# EAGLE schematic sr42-revB-kbd (EAGLE 9.6.2)

## Sheet 1 of 3
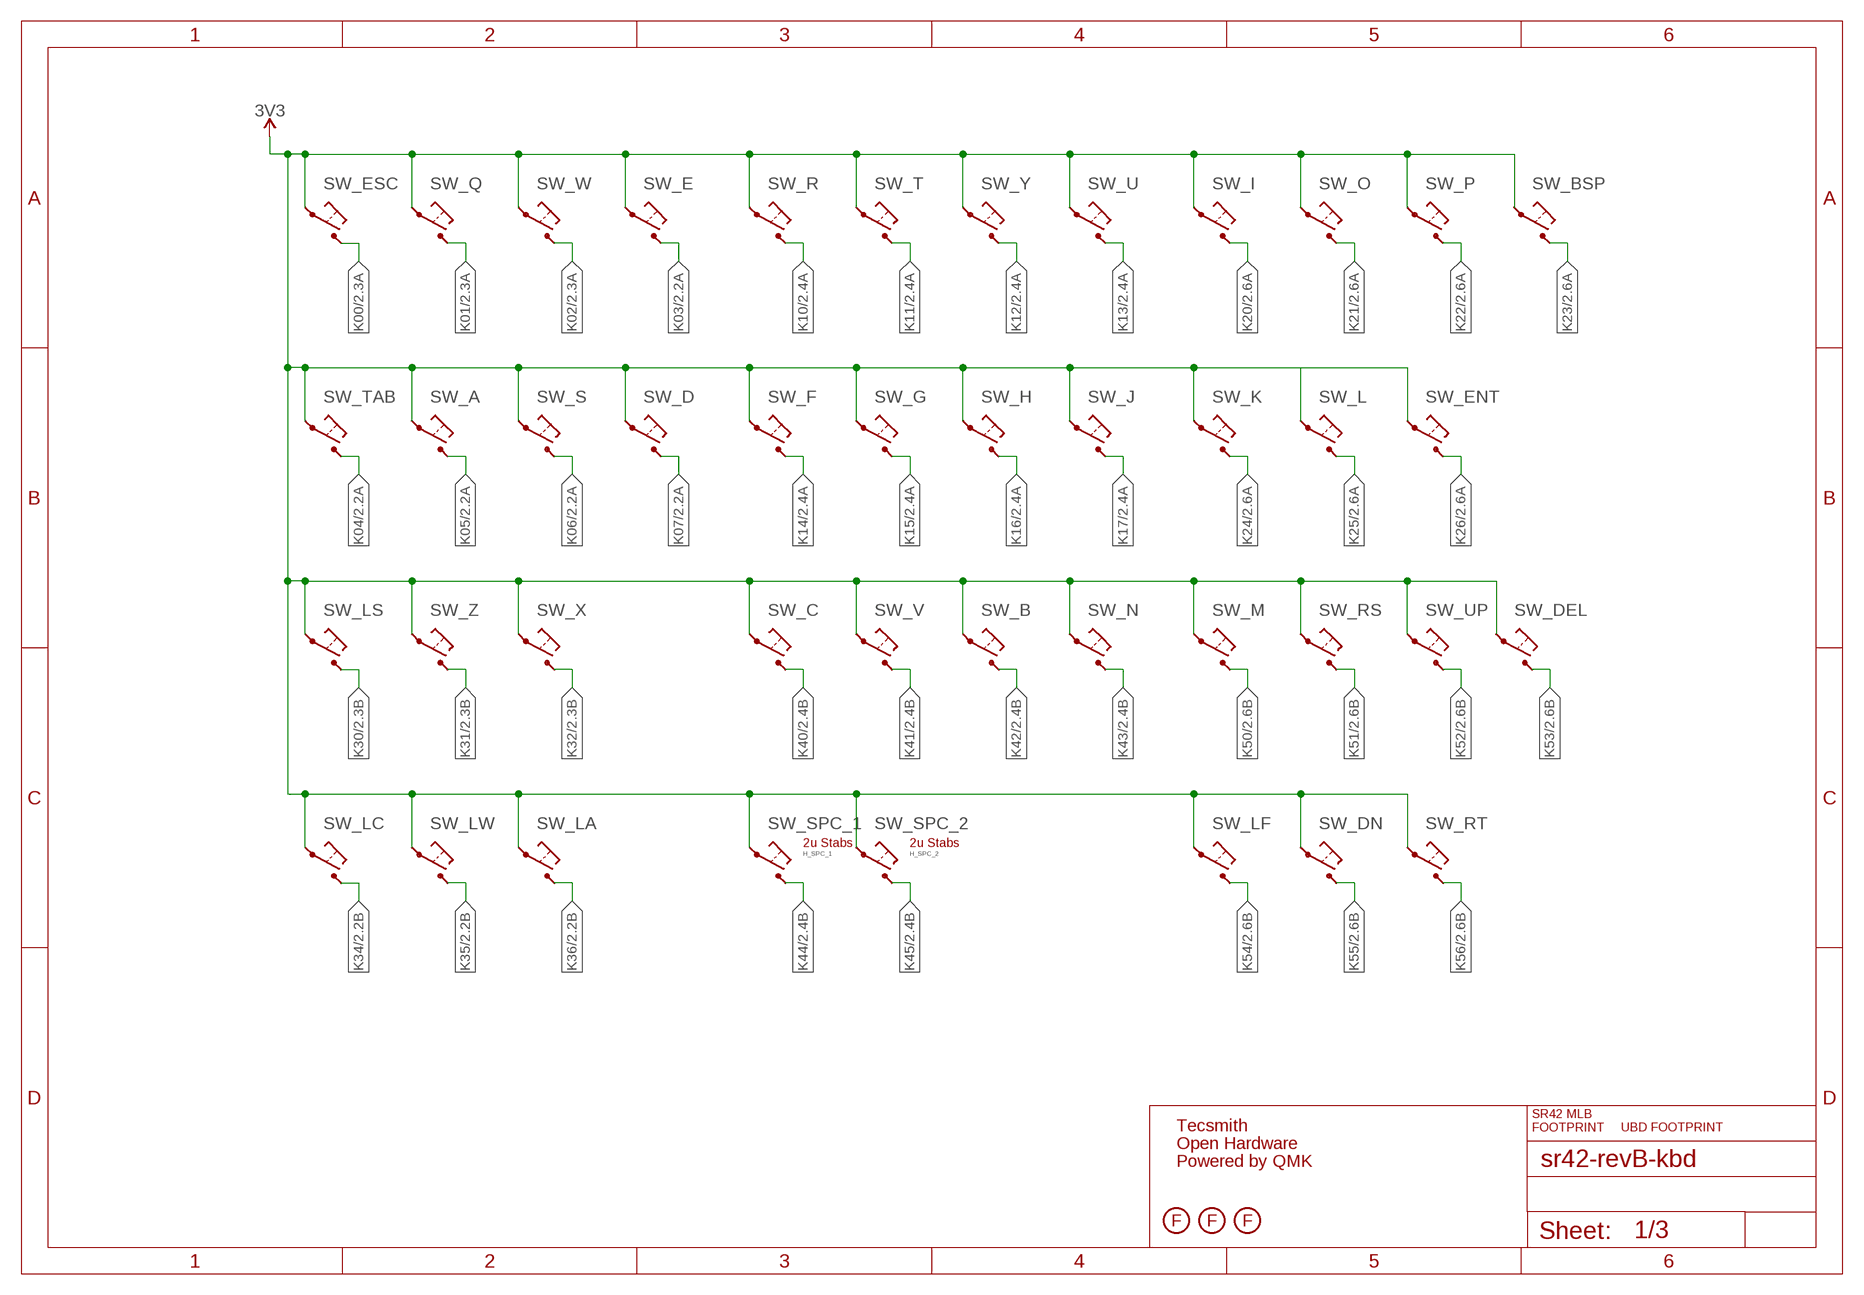
[diagram p0: schematic, sheet 1]

### Parts
H_SPC_1  MX-STABS-200U  [MX-STABS-200U]
H_SPC_2  MX-STABS-200U  [MX-STABS-200U]
LOGO1  OSHW-LOGOL  [OSHW-LOGO-L]
SW_A  MX-5-PIN-HOTSWAP-PAD  [MX-5-PIN-HOTSWAP-PAD]
SW_B  MX-5-PIN-HOTSWAP-PAD  [MX-5-PIN-HOTSWAP-PAD]
SW_BSP  MX-5-PIN-HOTSWAP-PAD  [MX-5-PIN-HOTSWAP-PAD]
SW_C  MX-5-PIN-HOTSWAP-PAD  [MX-5-PIN-HOTSWAP-PAD]
SW_D  MX-5-PIN-HOTSWAP-PAD  [MX-5-PIN-HOTSWAP-PAD]
SW_DEL  MX-5-PIN-HOTSWAP-PAD  [MX-5-PIN-HOTSWAP-PAD]
SW_DN  MX-5-PIN-HOTSWAP-PAD  [MX-5-PIN-HOTSWAP-PAD]
SW_E  MX-5-PIN-HOTSWAP-PAD  [MX-5-PIN-HOTSWAP-PAD]
SW_ENT  MX-5-PIN-HOTSWAP-PAD  [MX-5-PIN-HOTSWAP-PAD]
SW_ESC  MX-5-PIN-HOTSWAP-PAD  [MX-5-PIN-HOTSWAP-PAD]
SW_F  MX-5-PIN-HOTSWAP-PAD  [MX-5-PIN-HOTSWAP-PAD]
SW_G  MX-5-PIN-HOTSWAP-PAD  [MX-5-PIN-HOTSWAP-PAD]
SW_H  MX-5-PIN-HOTSWAP-PAD  [MX-5-PIN-HOTSWAP-PAD]
SW_I  MX-5-PIN-HOTSWAP-PAD  [MX-5-PIN-HOTSWAP-PAD]
SW_J  MX-5-PIN-HOTSWAP-PAD  [MX-5-PIN-HOTSWAP-PAD]
SW_K  MX-5-PIN-HOTSWAP-PAD  [MX-5-PIN-HOTSWAP-PAD]
SW_L  MX-5-PIN-HOTSWAP-PAD  [MX-5-PIN-HOTSWAP-PAD]
SW_LA  MX-5-PIN-HOTSWAP-PAD  [MX-5-PIN-HOTSWAP-PAD]
SW_LC  MX-5-PIN-HOTSWAP-PAD  [MX-5-PIN-HOTSWAP-PAD]
SW_LF  MX-5-PIN-HOTSWAP-PAD  [MX-5-PIN-HOTSWAP-PAD]
SW_LS  MX-5-PIN-HOTSWAP-PAD  [MX-5-PIN-HOTSWAP-PAD]
SW_LW  MX-5-PIN-HOTSWAP-PAD  [MX-5-PIN-HOTSWAP-PAD]
SW_M  MX-5-PIN-HOTSWAP-PAD  [MX-5-PIN-HOTSWAP-PAD]
SW_N  MX-5-PIN-HOTSWAP-PAD  [MX-5-PIN-HOTSWAP-PAD]
SW_O  MX-5-PIN-HOTSWAP-PAD  [MX-5-PIN-HOTSWAP-PAD]
SW_P  MX-5-PIN-HOTSWAP-PAD  [MX-5-PIN-HOTSWAP-PAD]
SW_Q  MX-5-PIN-HOTSWAP-PAD  [MX-5-PIN-HOTSWAP-PAD]
SW_R  MX-5-PIN-HOTSWAP-PAD  [MX-5-PIN-HOTSWAP-PAD]
SW_RS  MX-5-PIN-HOTSWAP-PAD  [MX-5-PIN-HOTSWAP-PAD]
SW_RT  MX-5-PIN-HOTSWAP-PAD  [MX-5-PIN-HOTSWAP-PAD]
SW_S  MX-5-PIN-HOTSWAP-PAD  [MX-5-PIN-HOTSWAP-PAD]
SW_SPC_1  MX-5-PIN-HOTSWAP-PAD  [MX-5-PIN-HOTSWAP-PAD]
SW_SPC_2  MX-5-PIN-HOTSWAP-PAD  [MX-5-PIN-HOTSWAP-PAD]
SW_T  MX-5-PIN-HOTSWAP-PAD  [MX-5-PIN-HOTSWAP-PAD]
SW_TAB  MX-5-PIN-HOTSWAP-PAD  [MX-5-PIN-HOTSWAP-PAD]
SW_U  MX-5-PIN-HOTSWAP-PAD  [MX-5-PIN-HOTSWAP-PAD]
SW_UP  MX-5-PIN-HOTSWAP-PAD  [MX-5-PIN-HOTSWAP-PAD]
SW_V  MX-5-PIN-HOTSWAP-PAD  [MX-5-PIN-HOTSWAP-PAD]
SW_W  MX-5-PIN-HOTSWAP-PAD  [MX-5-PIN-HOTSWAP-PAD]
SW_X  MX-5-PIN-HOTSWAP-PAD  [MX-5-PIN-HOTSWAP-PAD]
SW_Y  MX-5-PIN-HOTSWAP-PAD  [MX-5-PIN-HOTSWAP-PAD]
SW_Z  MX-5-PIN-HOTSWAP-PAD  [MX-5-PIN-HOTSWAP-PAD]
U$1  SR42_MLB_FOOTPRINT  [SR42_MLB_FOOTPRINT]
U$2  UBD_FOOTPRINT  [UDB_FOOTPRINT]
U$3  TECSMITH-LOGOLONG  [TECSMITH-NAME]
U$4  QMK_LOGO  [QMK_LOGO]
U$5  FIDUCIAL  [FIDUCIAL]
U$6  FIDUCIAL  [FIDUCIAL]
U$7  FIDUCIAL  [FIDUCIAL]

### Nets
K00: SW_ESC.1@1(P) SW_ESC.1@2(P) ; also sheet 2
K01: SW_Q.1@1(P) SW_Q.1@2(P) ; also sheet 2
K02: SW_W.1@1(P) SW_W.1@2(P) ; also sheet 2
K03: SW_E.1@1(P) SW_E.1@2(P) ; also sheet 2
K04: SW_TAB.1@1(P) SW_TAB.1@2(P) ; also sheet 2
K05: SW_A.1@1(P) SW_A.1@2(P) ; also sheet 2
K06: SW_S.1@1(P) SW_S.1@2(P) ; also sheet 2
K07: SW_D.1@1(P) SW_D.1@2(P) ; also sheet 2
K10: SW_R.1@1(P) SW_R.1@2(P) ; also sheet 2
K11: SW_T.1@1(P) SW_T.1@2(P) ; also sheet 2
K12: SW_Y.1@1(P) SW_Y.1@2(P) ; also sheet 2
K13: SW_U.1@1(P) SW_U.1@2(P) ; also sheet 2
K14: SW_F.1@1(P) SW_F.1@2(P) ; also sheet 2
K15: SW_G.1@1(P) SW_G.1@2(P) ; also sheet 2
K16: SW_H.1@1(P) SW_H.1@2(P) ; also sheet 2
K17: SW_J.1@1(P) SW_J.1@2(P) ; also sheet 2
K20: SW_I.1@1(P) SW_I.1@2(P) ; also sheet 2
K21: SW_O.1@1(P) SW_O.1@2(P) ; also sheet 2
K22: SW_P.1@1(P) SW_P.1@2(P) ; also sheet 2
K23: SW_BSP.1@1(P) SW_BSP.1@2(P) ; also sheet 2
K24: SW_K.1@1(P) SW_K.1@2(P) ; also sheet 2
K25: SW_L.1@1(P) SW_L.1@2(P) ; also sheet 2
K26: SW_ENT.1@1(P) SW_ENT.1@2(P) ; also sheet 2
K30: SW_LS.1@1(P) SW_LS.1@2(P) ; also sheet 2
K31: SW_Z.1@1(P) SW_Z.1@2(P) ; also sheet 2
K32: SW_X.1@1(P) SW_X.1@2(P) ; also sheet 2
K34: SW_LC.1@1(P) SW_LC.1@2(P) ; also sheet 2
K35: SW_LW.1@1(P) SW_LW.1@2(P) ; also sheet 2
K36: SW_LA.1@1(P) SW_LA.1@2(P) ; also sheet 2
K40: SW_C.1@1(P) SW_C.1@2(P) ; also sheet 2
K41: SW_V.1@1(P) SW_V.1@2(P) ; also sheet 2
K42: SW_B.1@1(P) SW_B.1@2(P) ; also sheet 2
K43: SW_N.1@1(P) SW_N.1@2(P) ; also sheet 2
K44: SW_SPC_1.1@1(P) SW_SPC_1.1@2(P) ; also sheet 2
K45: SW_SPC_2.1@1(P) SW_SPC_2.1@2(P) ; also sheet 2
K50: SW_M.1@1(P) SW_M.1@2(P) ; also sheet 2
K51: SW_RS.1@1(P) SW_RS.1@2(P) ; also sheet 2
K52: SW_UP.1@1(P) SW_UP.1@2(P) ; also sheet 2
K53: SW_DEL.1@1(P) SW_DEL.1@2(P) ; also sheet 2
K54: SW_LF.1@1(P) SW_LF.1@2(P) ; also sheet 2
K55: SW_DN.1@1(P) SW_DN.1@2(P) ; also sheet 2
K56: SW_RT.1@1(P) SW_RT.1@2(P) ; also sheet 2
VCC_2: SW_A.2@1(S) SW_A.2@2(S) SW_B.2@1(S) SW_B.2@2(S) SW_BSP.2@1(S) SW_BSP.2@2(S) SW_C.2@1(S) SW_C.2@2(S) SW_D.2@1(S) SW_D.2@2(S) SW_DEL.2@1(S) SW_DEL.2@2(S) SW_DN.2@1(S) SW_DN.2@2(S) SW_E.2@1(S) SW_E.2@2(S) SW_ENT.2@1(S) SW_ENT.2@2(S) SW_ESC.2@1(S) SW_ESC.2@2(S) SW_F.2@1(S) SW_F.2@2(S) SW_G.2@1(S) SW_G.2@2(S) SW_H.2@1(S) SW_H.2@2(S) SW_I.2@1(S) SW_I.2@2(S) SW_J.2@1(S) SW_J.2@2(S) SW_K.2@1(S) SW_K.2@2(S) SW_L.2@1(S) SW_L.2@2(S) SW_LA.2@1(S) SW_LA.2@2(S) SW_LC.2@1(S) SW_LC.2@2(S) SW_LF.2@1(S) SW_LF.2@2(S) SW_LS.2@1(S) SW_LS.2@2(S) SW_LW.2@1(S) SW_LW.2@2(S) SW_M.2@1(S) SW_M.2@2(S) SW_N.2@1(S) SW_N.2@2(S) SW_O.2@1(S) SW_O.2@2(S) SW_P.2@1(S) SW_P.2@2(S) SW_Q.2@1(S) SW_Q.2@2(S) SW_R.2@1(S) SW_R.2@2(S) SW_RS.2@1(S) SW_RS.2@2(S) SW_RT.2@1(S) SW_RT.2@2(S) SW_S.2@1(S) SW_S.2@2(S) SW_SPC_1.2@1(S) SW_SPC_1.2@2(S) SW_SPC_2.2@1(S) SW_SPC_2.2@2(S) SW_T.2@1(S) SW_T.2@2(S) SW_TAB.2@1(S) SW_TAB.2@2(S) SW_U.2@1(S) SW_U.2@2(S) SW_UP.2@1(S) SW_UP.2@2(S) SW_V.2@1(S) SW_V.2@2(S) SW_W.2@1(S) SW_W.2@2(S) SW_X.2@1(S) SW_X.2@2(S) SW_Y.2@1(S) SW_Y.2@2(S) SW_Z.2@1(S) SW_Z.2@2(S) ; supply symbol labelled 3V3 ; also sheet 2

## Sheet 2 of 3
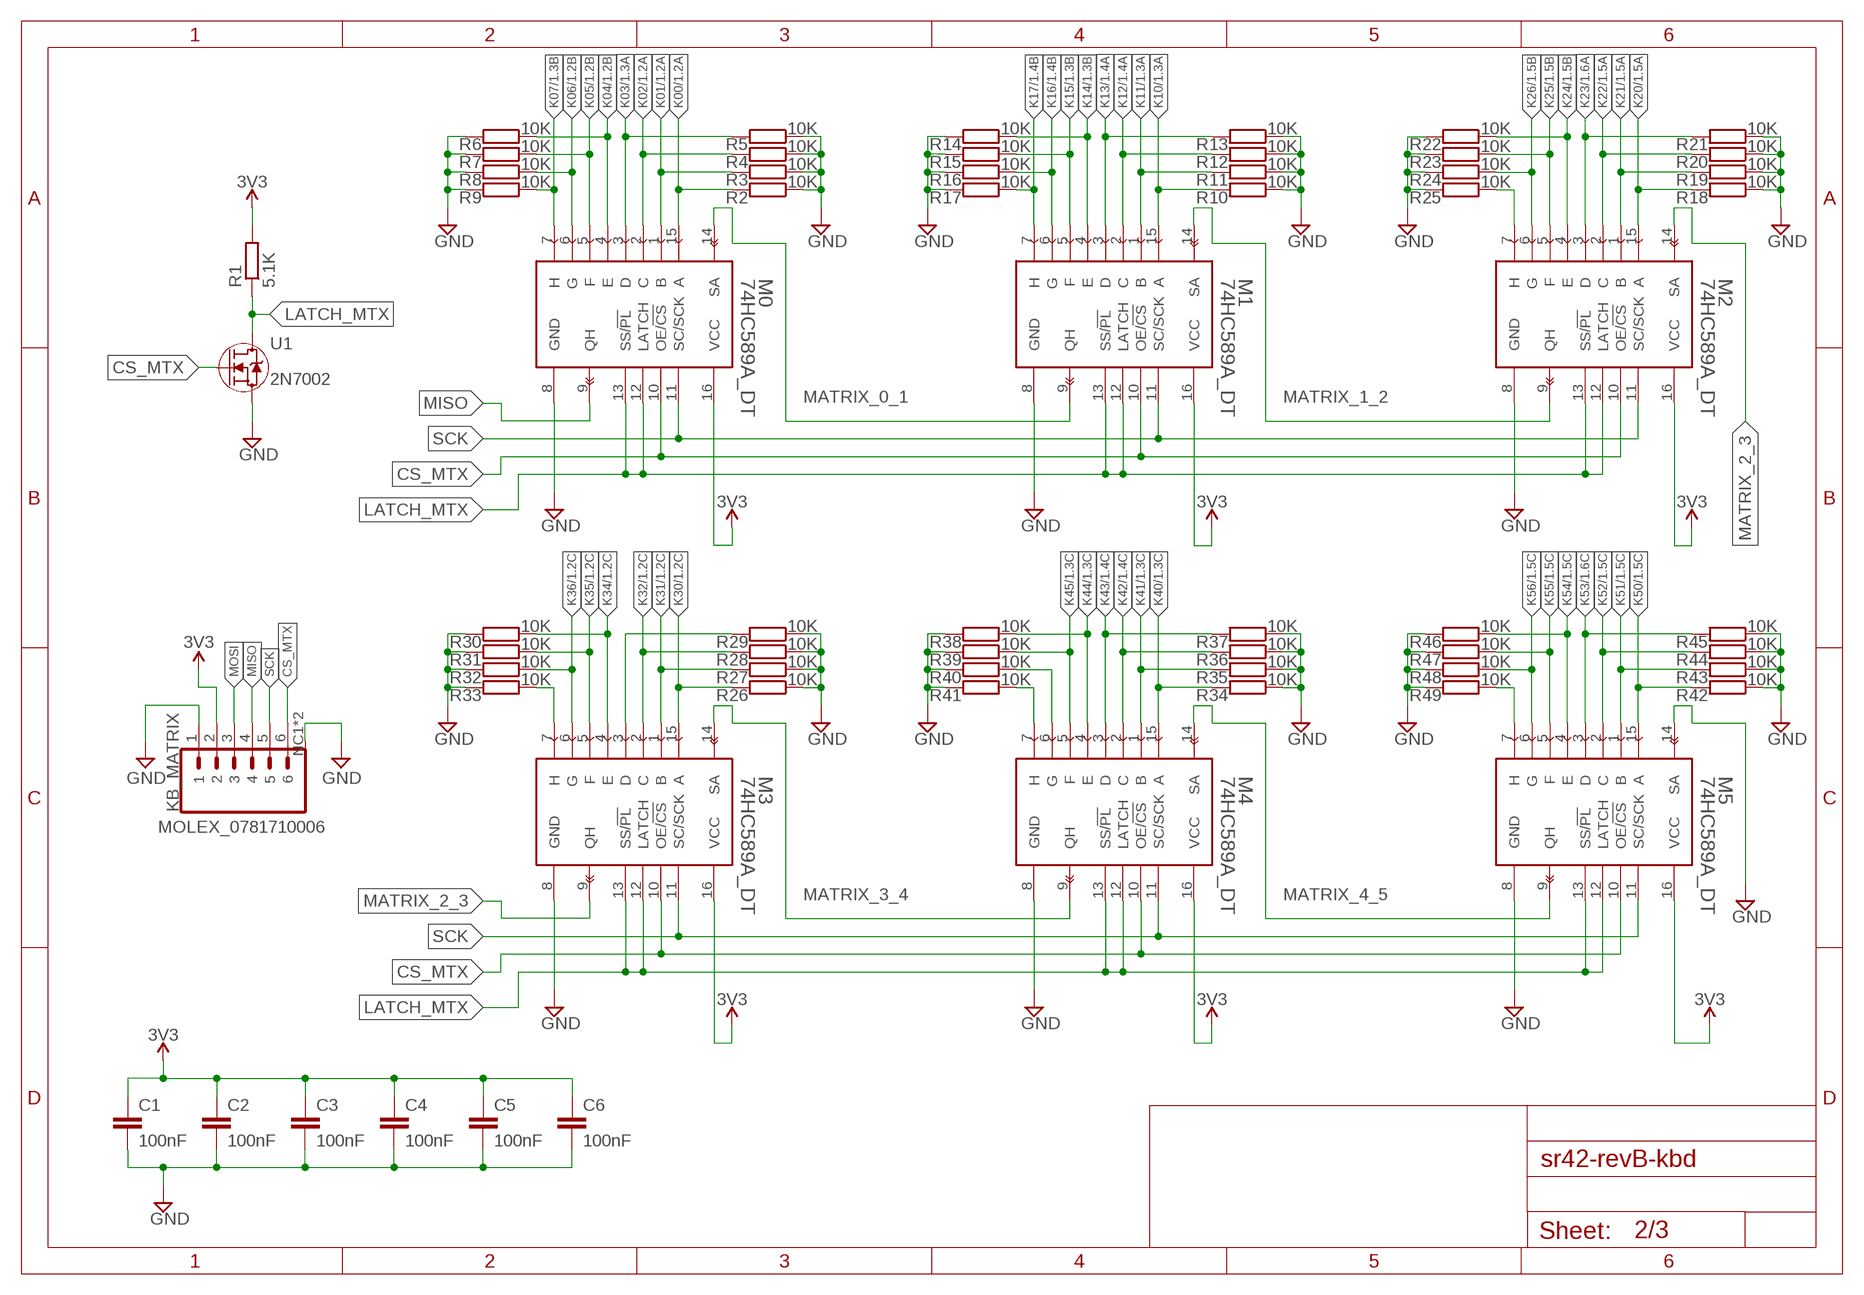
[diagram p1: schematic, sheet 2]

### Parts
C1  100nF  C-EUC0603  [C0603]
C2  100nF  C-EUC0603  [C0603]
C3  100nF  C-EUC0603  [C0603]
C4  100nF  C-EUC0603  [C0603]
C5  100nF  C-EUC0603  [C0603]
C6  100nF  C-EUC0603  [C0603]
KB_MATRIX  MOLEX_0781710006  [MOLEX_781710006]
M0  74HC589A_DT  [TSSOP16]
M1  74HC589A_DT  [TSSOP16]
M2  74HC589A_DT  [TSSOP16]
M3  74HC589A_DT  [TSSOP16]
M4  74HC589A_DT  [TSSOP16]
M5  74HC589A_DT  [TSSOP16]
R1  5.1K  R-EU_R0603  [R0603]
R2  10K  R-EU_R0603  [R0603]
R3  10K  R-EU_R0603  [R0603]
R4  10K  R-EU_R0603  [R0603]
R5  10K  R-EU_R0603  [R0603]
R6  10K  R-EU_R0603  [R0603]
R7  10K  R-EU_R0603  [R0603]
R8  10K  R-EU_R0603  [R0603]
R9  10K  R-EU_R0603  [R0603]
R10  10K  R-EU_R0603  [R0603]
R11  10K  R-EU_R0603  [R0603]
R12  10K  R-EU_R0603  [R0603]
R13  10K  R-EU_R0603  [R0603]
R14  10K  R-EU_R0603  [R0603]
R15  10K  R-EU_R0603  [R0603]
R16  10K  R-EU_R0603  [R0603]
R17  10K  R-EU_R0603  [R0603]
R18  10K  R-EU_R0603  [R0603]
R19  10K  R-EU_R0603  [R0603]
R20  10K  R-EU_R0603  [R0603]
R21  10K  R-EU_R0603  [R0603]
R22  10K  R-EU_R0603  [R0603]
R23  10K  R-EU_R0603  [R0603]
R24  10K  R-EU_R0603  [R0603]
R25  10K  R-EU_R0603  [R0603]
R26  10K  R-EU_R0603  [R0603]
R27  10K  R-EU_R0603  [R0603]
R28  10K  R-EU_R0603  [R0603]
R29  10K  R-EU_R0603  [R0603]
R30  10K  R-EU_R0603  [R0603]
R31  10K  R-EU_R0603  [R0603]
R32  10K  R-EU_R0603  [R0603]
R33  10K  R-EU_R0603  [R0603]
R34  10K  R-EU_R0603  [R0603]
R35  10K  R-EU_R0603  [R0603]
R36  10K  R-EU_R0603  [R0603]
R37  10K  R-EU_R0603  [R0603]
R38  10K  R-EU_R0603  [R0603]
R39  10K  R-EU_R0603  [R0603]
R40  10K  R-EU_R0603  [R0603]
R41  10K  R-EU_R0603  [R0603]
R42  10K  R-EU_R0603  [R0603]
R43  10K  R-EU_R0603  [R0603]
R44  10K  R-EU_R0603  [R0603]
R45  10K  R-EU_R0603  [R0603]
R46  10K  R-EU_R0603  [R0603]
R47  10K  R-EU_R0603  [R0603]
R48  10K  R-EU_R0603  [R0603]
R49  10K  R-EU_R0603  [R0603]
U1  2N7002  [TO-236AB_NEX]

### Nets
CS_MTX: KB_MATRIX.6 M0.10(OE/!CS) M1.10(OE/!CS) M2.10(OE/!CS) M3.10(OE/!CS) M4.10(OE/!CS) M5.10(OE/!CS) U1.1
GND: C1.2 C2.2 C3.2 C4.2 C5.2 C6.2 KB_MATRIX.1 KB_MATRIX.NC1(M) KB_MATRIX.NC2(M) M0.8(GND) M1.8(GND) M2.8(GND) M3.8(GND) M4.8(GND) M5.8(GND) M5.14(SA) R2.1 R3.1 R4.1 R5.1 R6.2 R7.2 R8.2 R9.2 R10.1 R11.1 R12.1 R13.1 R14.2 R15.2 R16.2 R17.2 R18.1 R19.1 R20.1 R21.1 R22.2 R23.2 R24.2 R25.2 R26.1 R27.1 R28.1 R29.1 R30.2 R31.2 R32.2 R33.2 R34.1 R35.1 R36.1 R37.1 R38.2 R39.2 R40.2 R41.2 R42.1 R43.1 R44.1 R45.1 R46.2 R47.2 R48.2 R49.2 U1.2 ; also sheet 3
K00: M0.15(A) R2.2 ; also sheet 1
K01: M0.1(B) R3.2 ; also sheet 1
K02: M0.2(C) R4.2 ; also sheet 1
K03: M0.3(D) R5.2 ; also sheet 1
K04: M0.4(E) R6.1 ; also sheet 1
K05: M0.5(F) R7.1 ; also sheet 1
K06: M0.6(G) R8.1 ; also sheet 1
K07: M0.7(H) R9.1 ; also sheet 1
K10: M1.15(A) R10.2 ; also sheet 1
K11: M1.1(B) R11.2 ; also sheet 1
K12: M1.2(C) R12.2 ; also sheet 1
K13: M1.3(D) R13.2 ; also sheet 1
K14: M1.4(E) R14.1 ; also sheet 1
K15: M1.5(F) R15.1 ; also sheet 1
K16: M1.6(G) R16.1 ; also sheet 1
K17: M1.7(H) R17.1 ; also sheet 1
K20: M2.15(A) R18.2 ; also sheet 1
K21: M2.1(B) R19.2 ; also sheet 1
K22: M2.2(C) R20.2 ; also sheet 1
K23: M2.3(D) R21.2 ; also sheet 1
K24: M2.4(E) R22.1 ; also sheet 1
K25: M2.5(F) R23.1 ; also sheet 1
K26: M2.6(G) R24.1 ; also sheet 1
K27: M2.7(H) R25.1
K30: M3.15(A) R26.2 ; also sheet 1
K31: M3.1(B) R27.2 ; also sheet 1
K32: M3.2(C) R28.2 ; also sheet 1
K33: M3.3(D) R29.2
K34: M3.4(E) R30.1 ; also sheet 1
K35: M3.5(F) R31.1 ; also sheet 1
K36: M3.6(G) R32.1 ; also sheet 1
K37: M3.7(H) R33.1
K40: M4.15(A) R34.2 ; also sheet 1
K41: M4.1(B) R35.2 ; also sheet 1
K42: M4.2(C) R36.2 ; also sheet 1
K43: M4.3(D) R37.2 ; also sheet 1
K44: M4.4(E) R38.1 ; also sheet 1
K45: M4.5(F) R39.1 ; also sheet 1
K46: M4.6(G) R40.1
K47: M4.7(H) R41.1
K50: M5.15(A) R42.2 ; also sheet 1
K51: M5.1(B) R43.2 ; also sheet 1
K52: M5.2(C) R44.2 ; also sheet 1
K53: M5.3(D) R45.2 ; also sheet 1
K54: M5.4(E) R46.1 ; also sheet 1
K55: M5.5(F) R47.1 ; also sheet 1
K56: M5.6(G) R48.1 ; also sheet 1
K57: M5.7(H) R49.1
LATCH_MTX: M0.12(LATCH) M0.13(SS/!PL) M1.12(LATCH) M1.13(SS/!PL) M2.12(LATCH) M2.13(SS/!PL) M3.12(LATCH) M3.13(SS/!PL) M4.12(LATCH) M4.13(SS/!PL) M5.12(LATCH) M5.13(SS/!PL) R1.1 U1.3
MATRIX_0_1: M0.14(SA) M1.9(QH)
MATRIX_1_2: M1.14(SA) M2.9(QH)
MATRIX_2_3: M2.14(SA) M3.9(QH)
MATRIX_3_4: M3.14(SA) M4.9(QH)
MATRIX_4_5: M4.14(SA) M5.9(QH)
MISO: KB_MATRIX.4 M0.9(QH)
MOSI: KB_MATRIX.3
SCK: KB_MATRIX.5 M0.11(SC/SCK) M1.11(SC/SCK) M2.11(SC/SCK) M3.11(SC/SCK) M4.11(SC/SCK) M5.11(SC/SCK)
VCC_2: C1.1 C2.1 C3.1 C4.1 C5.1 C6.1 KB_MATRIX.2 M0.16(VCC) M1.16(VCC) M2.16(VCC) M3.16(VCC) M4.16(VCC) M5.16(VCC) R1.2 ; supply symbol labelled 3V3 ; also sheet 1

## Sheet 3 of 3
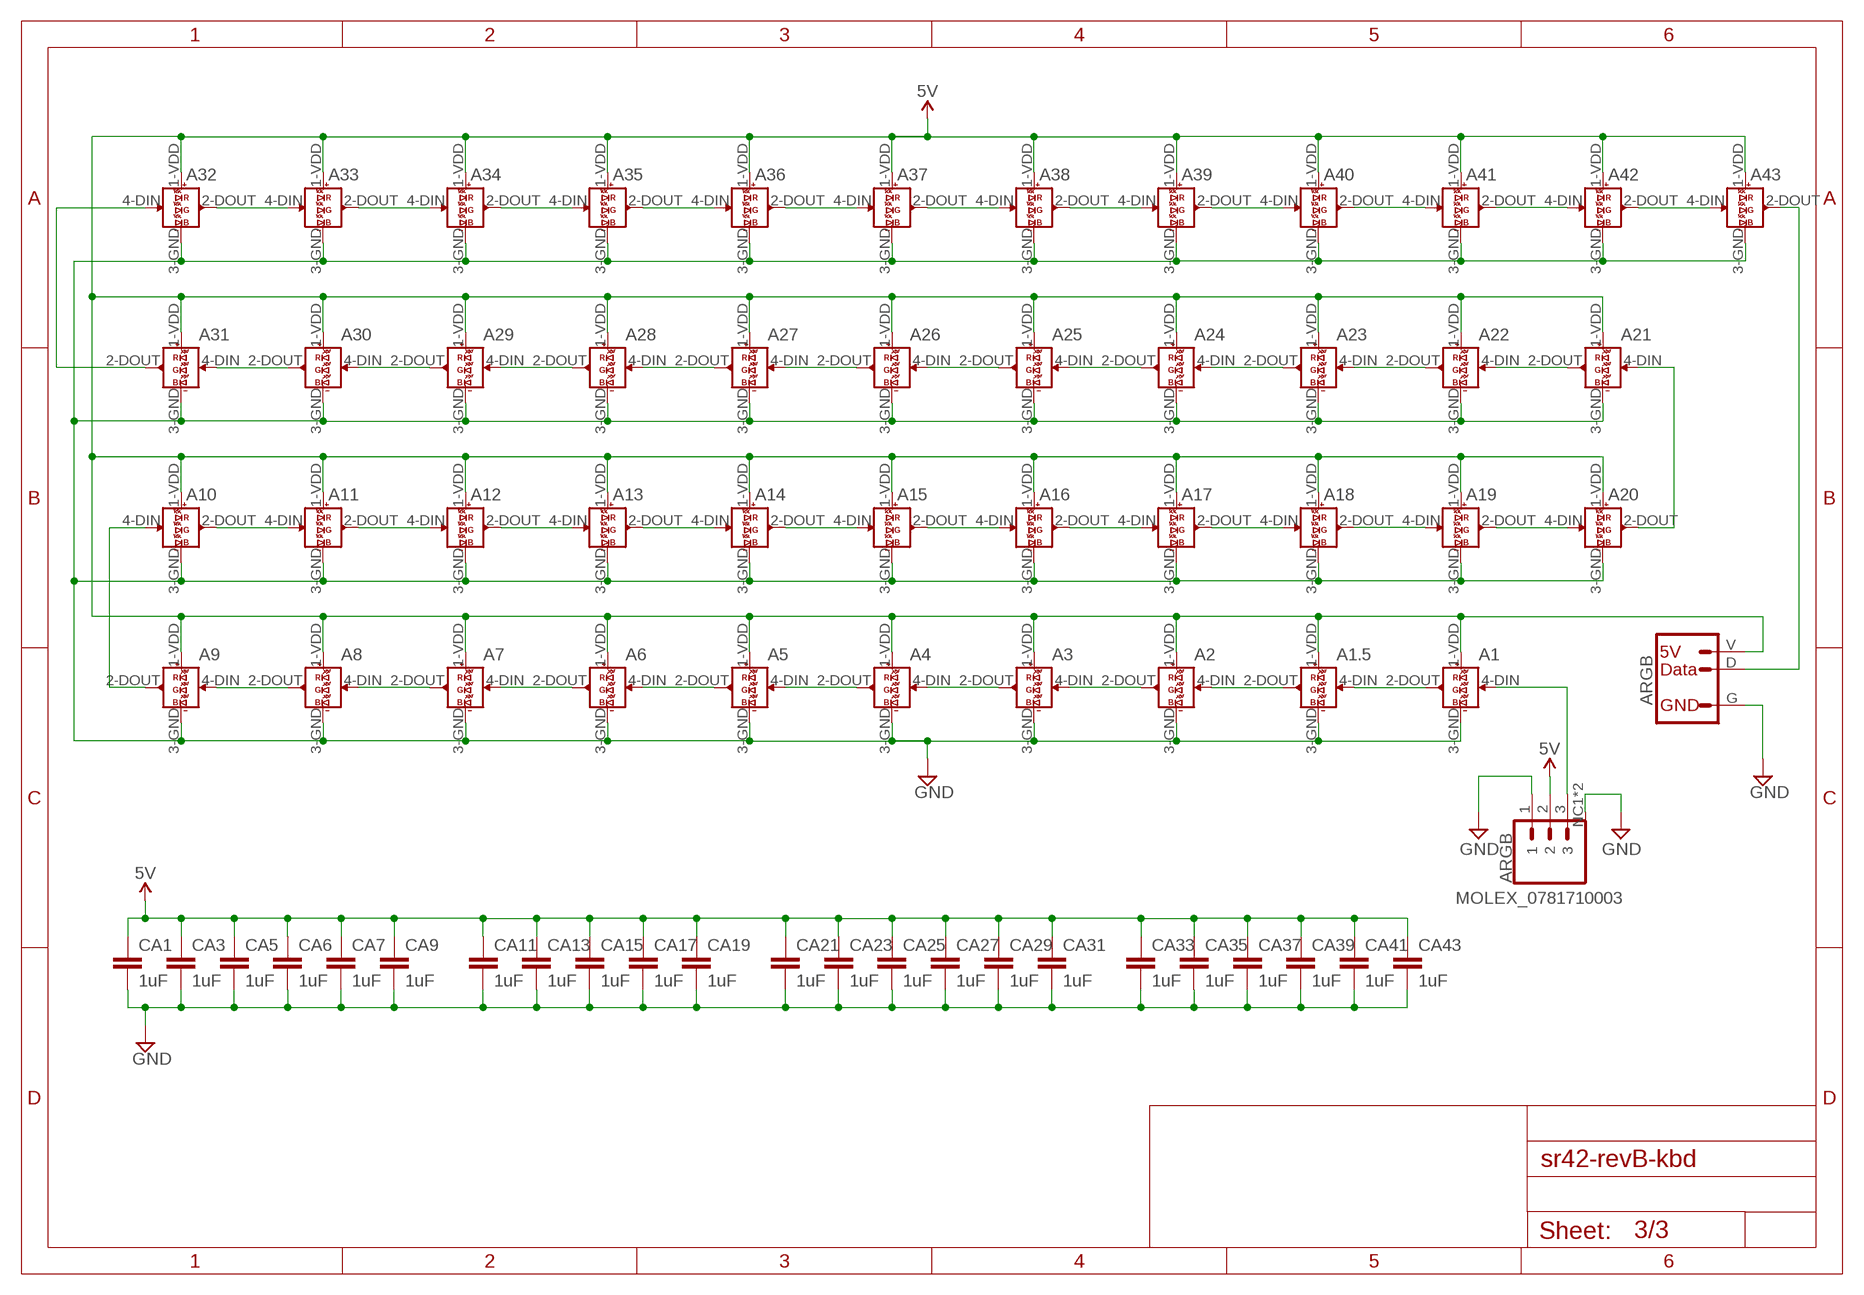
[diagram p2: schematic, sheet 3]

### Parts
A1  SK6812-E-REVERSE_V2  [SK6812-E-MILL_V2]
A1.5  SK6812-E-REVERSE_V2  [SK6812-E-MILL_V2]
A2  SK6812-E-REVERSE_V2  [SK6812-E-MILL_V2]
A3  SK6812-E-REVERSE_V2  [SK6812-E-MILL_V2]
A4  SK6812-E-REVERSE_V2  [SK6812-E-MILL_V2]
A5  SK6812-E-REVERSE_V2  [SK6812-E-MILL_V2]
A6  SK6812-E-REVERSE_V2  [SK6812-E-MILL_V2]
A7  SK6812-E-REVERSE_V2  [SK6812-E-MILL_V2]
A8  SK6812-E-REVERSE_V2  [SK6812-E-MILL_V2]
A9  SK6812-E-REVERSE_V2  [SK6812-E-MILL_V2]
A10  SK6812-E-REVERSE_V2  [SK6812-E-MILL_V2]
A11  SK6812-E-REVERSE_V2  [SK6812-E-MILL_V2]
A12  SK6812-E-REVERSE_V2  [SK6812-E-MILL_V2]
A13  SK6812-E-REVERSE_V2  [SK6812-E-MILL_V2]
A14  SK6812-E-REVERSE_V2  [SK6812-E-MILL_V2]
A15  SK6812-E-REVERSE_V2  [SK6812-E-MILL_V2]
A16  SK6812-E-REVERSE_V2  [SK6812-E-MILL_V2]
A17  SK6812-E-REVERSE_V2  [SK6812-E-MILL_V2]
A18  SK6812-E-REVERSE_V2  [SK6812-E-MILL_V2]
A19  SK6812-E-REVERSE_V2  [SK6812-E-MILL_V2]
A20  SK6812-E-REVERSE_V2  [SK6812-E-MILL_V2]
A21  SK6812-E-REVERSE_V2  [SK6812-E-MILL_V2]
A22  SK6812-E-REVERSE_V2  [SK6812-E-MILL_V2]
A23  SK6812-E-REVERSE_V2  [SK6812-E-MILL_V2]
A24  SK6812-E-REVERSE_V2  [SK6812-E-MILL_V2]
A25  SK6812-E-REVERSE_V2  [SK6812-E-MILL_V2]
A26  SK6812-E-REVERSE_V2  [SK6812-E-MILL_V2]
A27  SK6812-E-REVERSE_V2  [SK6812-E-MILL_V2]
A28  SK6812-E-REVERSE_V2  [SK6812-E-MILL_V2]
A29  SK6812-E-REVERSE_V2  [SK6812-E-MILL_V2]
A30  SK6812-E-REVERSE_V2  [SK6812-E-MILL_V2]
A31  SK6812-E-REVERSE_V2  [SK6812-E-MILL_V2]
A32  SK6812-E-REVERSE_V2  [SK6812-E-MILL_V2]
A33  SK6812-E-REVERSE_V2  [SK6812-E-MILL_V2]
A34  SK6812-E-REVERSE_V2  [SK6812-E-MILL_V2]
A35  SK6812-E-REVERSE_V2  [SK6812-E-MILL_V2]
A36  SK6812-E-REVERSE_V2  [SK6812-E-MILL_V2]
A37  SK6812-E-REVERSE_V2  [SK6812-E-MILL_V2]
A38  SK6812-E-REVERSE_V2  [SK6812-E-MILL_V2]
A39  SK6812-E-REVERSE_V2  [SK6812-E-MILL_V2]
A40  SK6812-E-REVERSE_V2  [SK6812-E-MILL_V2]
A41  SK6812-E-REVERSE_V2  [SK6812-E-MILL_V2]
A42  SK6812-E-REVERSE_V2  [SK6812-E-MILL_V2]
A43  SK6812-E-REVERSE_V2  [SK6812-E-MILL_V2]
ARGB  MOLEX_0781710003  [MOLEX_781710003]
CA1  1uF  C-EUC0603  [C0603]
CA3  1uF  C-EUC0603  [C0603]
CA5  1uF  C-EUC0603  [C0603]
CA6  1uF  C-EUC0603  [C0603]
CA7  1uF  C-EUC0603  [C0603]
CA9  1uF  C-EUC0603  [C0603]
CA11  1uF  C-EUC0603  [C0603]
CA13  1uF  C-EUC0603  [C0603]
CA15  1uF  C-EUC0603  [C0603]
CA17  1uF  C-EUC0603  [C0603]
CA19  1uF  C-EUC0603  [C0603]
CA21  1uF  C-EUC0603  [C0603]
CA23  1uF  C-EUC0603  [C0603]
CA25  1uF  C-EUC0603  [C0603]
CA27  1uF  C-EUC0603  [C0603]
CA29  1uF  C-EUC0603  [C0603]
CA31  1uF  C-EUC0603  [C0603]
CA33  1uF  C-EUC0603  [C0603]
CA35  1uF  C-EUC0603  [C0603]
CA37  1uF  C-EUC0603  [C0603]
CA39  1uF  C-EUC0603  [C0603]
CA41  1uF  C-EUC0603  [C0603]
CA43  1uF  C-EUC0603  [C0603]
I44  ARGB  [ARGB]

### Nets
GND: A1.3-GND(3_GND) A1.5.3-GND(3_GND) A2.3-GND(3_GND) A3.3-GND(3_GND) A4.3-GND(3_GND) A5.3-GND(3_GND) A6.3-GND(3_GND) A7.3-GND(3_GND) A8.3-GND(3_GND) A9.3-GND(3_GND) A10.3-GND(3_GND) A11.3-GND(3_GND) A12.3-GND(3_GND) A13.3-GND(3_GND) A14.3-GND(3_GND) A15.3-GND(3_GND) A16.3-GND(3_GND) A17.3-GND(3_GND) A18.3-GND(3_GND) A19.3-GND(3_GND) A20.3-GND(3_GND) A21.3-GND(3_GND) A22.3-GND(3_GND) A23.3-GND(3_GND) A24.3-GND(3_GND) A25.3-GND(3_GND) A26.3-GND(3_GND) A27.3-GND(3_GND) A28.3-GND(3_GND) A29.3-GND(3_GND) A30.3-GND(3_GND) A31.3-GND(3_GND) A32.3-GND(3_GND) A33.3-GND(3_GND) A34.3-GND(3_GND) A35.3-GND(3_GND) A36.3-GND(3_GND) A37.3-GND(3_GND) A38.3-GND(3_GND) A39.3-GND(3_GND) A40.3-GND(3_GND) A41.3-GND(3_GND) A42.3-GND(3_GND) A43.3-GND(3_GND) ARGB.1 ARGB.NC1(M) ARGB.NC2(M) CA1.2 CA3.2 CA5.2 CA6.2 CA7.2 CA9.2 CA11.2 CA13.2 CA15.2 CA17.2 CA19.2 CA21.2 CA23.2 CA25.2 CA27.2 CA29.2 CA31.2 CA33.2 CA35.2 CA37.2 CA39.2 CA41.2 CA43.2 I44.G ; also sheet 2
N$1: A1.4-DIN(4_DIN) ARGB.3
N$2: A43.2-DOUT(2_DOUT) I44.D
N$3: A9.2-DOUT(2_DOUT) A10.4-DIN(4_DIN)
N$4: A32.2-DOUT(2_DOUT) A33.4-DIN(4_DIN)
N$5: A33.2-DOUT(2_DOUT) A34.4-DIN(4_DIN)
N$6: A34.2-DOUT(2_DOUT) A35.4-DIN(4_DIN)
N$7: A35.2-DOUT(2_DOUT) A36.4-DIN(4_DIN)
N$8: A36.2-DOUT(2_DOUT) A37.4-DIN(4_DIN)
N$9: A1.5.2-DOUT(2_DOUT) A2.4-DIN(4_DIN)
N$10: A1.2-DOUT(2_DOUT) A1.5.4-DIN(4_DIN)
N$11: A37.2-DOUT(2_DOUT) A38.4-DIN(4_DIN)
N$12: A38.2-DOUT(2_DOUT) A39.4-DIN(4_DIN)
N$13: A39.2-DOUT(2_DOUT) A40.4-DIN(4_DIN)
N$14: A23.2-DOUT(2_DOUT) A24.4-DIN(4_DIN)
N$15: A24.2-DOUT(2_DOUT) A25.4-DIN(4_DIN)
N$16: A25.2-DOUT(2_DOUT) A26.4-DIN(4_DIN)
N$17: A26.2-DOUT(2_DOUT) A27.4-DIN(4_DIN)
N$18: A27.2-DOUT(2_DOUT) A28.4-DIN(4_DIN)
N$20: A29.2-DOUT(2_DOUT) A30.4-DIN(4_DIN)
N$21: A30.2-DOUT(2_DOUT) A31.4-DIN(4_DIN)
N$22: A20.2-DOUT(2_DOUT) A21.4-DIN(4_DIN)
N$23: A10.2-DOUT(2_DOUT) A11.4-DIN(4_DIN)
N$24: A11.2-DOUT(2_DOUT) A12.4-DIN(4_DIN)
N$25: A12.2-DOUT(2_DOUT) A13.4-DIN(4_DIN)
N$26: A13.2-DOUT(2_DOUT) A14.4-DIN(4_DIN)
N$27: A14.2-DOUT(2_DOUT) A15.4-DIN(4_DIN)
N$28: A15.2-DOUT(2_DOUT) A16.4-DIN(4_DIN)
N$29: A16.2-DOUT(2_DOUT) A17.4-DIN(4_DIN)
N$30: A40.2-DOUT(2_DOUT) A41.4-DIN(4_DIN)
N$31: A5.2-DOUT(2_DOUT) A6.4-DIN(4_DIN)
N$32: A6.2-DOUT(2_DOUT) A7.4-DIN(4_DIN)
N$33: A7.2-DOUT(2_DOUT) A8.4-DIN(4_DIN)
N$34: A8.2-DOUT(2_DOUT) A9.4-DIN(4_DIN)
N$36: A31.2-DOUT(2_DOUT) A32.4-DIN(4_DIN)
N$40: A19.2-DOUT(2_DOUT) A20.4-DIN(4_DIN)
N$41: A41.2-DOUT(2_DOUT) A42.4-DIN(4_DIN)
N$42: A28.2-DOUT(2_DOUT) A29.4-DIN(4_DIN)
N$47: A42.2-DOUT(2_DOUT) A43.4-DIN(4_DIN)
N$48: A21.2-DOUT(2_DOUT) A22.4-DIN(4_DIN)
N$49: A22.2-DOUT(2_DOUT) A23.4-DIN(4_DIN)
N$50: A2.2-DOUT(2_DOUT) A3.4-DIN(4_DIN)
N$51: A3.2-DOUT(2_DOUT) A4.4-DIN(4_DIN)
N$52: A4.2-DOUT(2_DOUT) A5.4-DIN(4_DIN)
N$54: A17.2-DOUT(2_DOUT) A18.4-DIN(4_DIN)
N$55: A18.2-DOUT(2_DOUT) A19.4-DIN(4_DIN)
VCC_1: A1.1-VDD(1_VDD) A1.5.1-VDD(1_VDD) A2.1-VDD(1_VDD) A3.1-VDD(1_VDD) A4.1-VDD(1_VDD) A5.1-VDD(1_VDD) A6.1-VDD(1_VDD) A7.1-VDD(1_VDD) A8.1-VDD(1_VDD) A9.1-VDD(1_VDD) A10.1-VDD(1_VDD) A11.1-VDD(1_VDD) A12.1-VDD(1_VDD) A13.1-VDD(1_VDD) A14.1-VDD(1_VDD) A15.1-VDD(1_VDD) A16.1-VDD(1_VDD) A17.1-VDD(1_VDD) A18.1-VDD(1_VDD) A19.1-VDD(1_VDD) A20.1-VDD(1_VDD) A21.1-VDD(1_VDD) A22.1-VDD(1_VDD) A23.1-VDD(1_VDD) A24.1-VDD(1_VDD) A25.1-VDD(1_VDD) A26.1-VDD(1_VDD) A27.1-VDD(1_VDD) A28.1-VDD(1_VDD) A29.1-VDD(1_VDD) A30.1-VDD(1_VDD) A31.1-VDD(1_VDD) A32.1-VDD(1_VDD) A33.1-VDD(1_VDD) A34.1-VDD(1_VDD) A35.1-VDD(1_VDD) A36.1-VDD(1_VDD) A37.1-VDD(1_VDD) A38.1-VDD(1_VDD) A39.1-VDD(1_VDD) A40.1-VDD(1_VDD) A41.1-VDD(1_VDD) A42.1-VDD(1_VDD) A43.1-VDD(1_VDD) ARGB.2 CA1.1 CA3.1 CA5.1 CA6.1 CA7.1 CA9.1 CA11.1 CA13.1 CA15.1 CA17.1 CA19.1 CA21.1 CA23.1 CA25.1 CA27.1 CA29.1 CA31.1 CA33.1 CA35.1 CA37.1 CA39.1 CA41.1 CA43.1 I44.V ; supply symbol labelled 5V

## Library data of the parts
A1 A1.5 A2-A43 = tecsmith_keyboards:SK6812-E-REVERSE_V2
ARGB = molex-pico-ezmate:MOLEX_0781710003
C1-C6 CA1 CA3 CA5-CA7 CA9 CA11 CA13 CA15 CA17 CA19 CA21 CA23 CA25 CA27 CA29 CA31 CA33 CA35 CA37 CA39 CA41 CA43 = rcl:C-EU: CAPACITOR, European symbol; SPICEPREFIX: C
H_SPC_1 H_SPC_2 = ts_keyboards:MX-STABS-200U
I44 = __temp_to_delete:ARGB
KB_MATRIX = molex-pico-ezmate:MOLEX_0781710006
LOGO1 = random_logos:OSHW-LOGO: Open-Source Hardware (OSHW) Logo This logo indicates the piece of hardware it is found on incorporates a OSHW license and/or adheres to the definition of open source hardware found here: http://freedomdefined.org/OSHW
M0 M1-M5 = __untitled:74HC589A_DT
R1-R49 = rcl:R-EU_: RESISTOR, European symbol; SPICEPREFIX: R
SW_A SW_B SW_BSP SW_C SW_D SW_DEL SW_DN SW_E SW_ENT SW_ESC SW_F SW_G SW_H SW_I SW_J SW_K SW_L SW_LA SW_LC SW_LF SW_LS SW_LW SW_M SW_N SW_O SW_P SW_Q SW_R SW_RS SW_RT SW_S SW_SPC_1 SW_SPC_2 SW_T SW_TAB SW_U SW_UP SW_V SW_W SW_X SW_Y SW_Z = ts_keyboards:MX-5-PIN-HOTSWAP-PAD
U1 = __temp_to_delete:2N7002; COPYRIGHT: Copyright (C) 2024 Ultra Librarian. All rights reserved.; MANUFACTURER_PART_NUMBER: 2N7002,215; MFR_NAME: Nexperia
U$1 = __temp_to_delete:SR42_MLB_FOOTPRINT
U$2 = __temp_to_delete:UBD_FOOTPRINT
U$3 = random_logos:TECSMITH-LOGO
U$4 = random_logos:QMK_LOGO
U$5-U$7 = __temp_to_delete:FIDUCIAL

## Net classes
2 gnd: width 0.254 mm